# EAGLE design buffer (EAGLE 6.1)
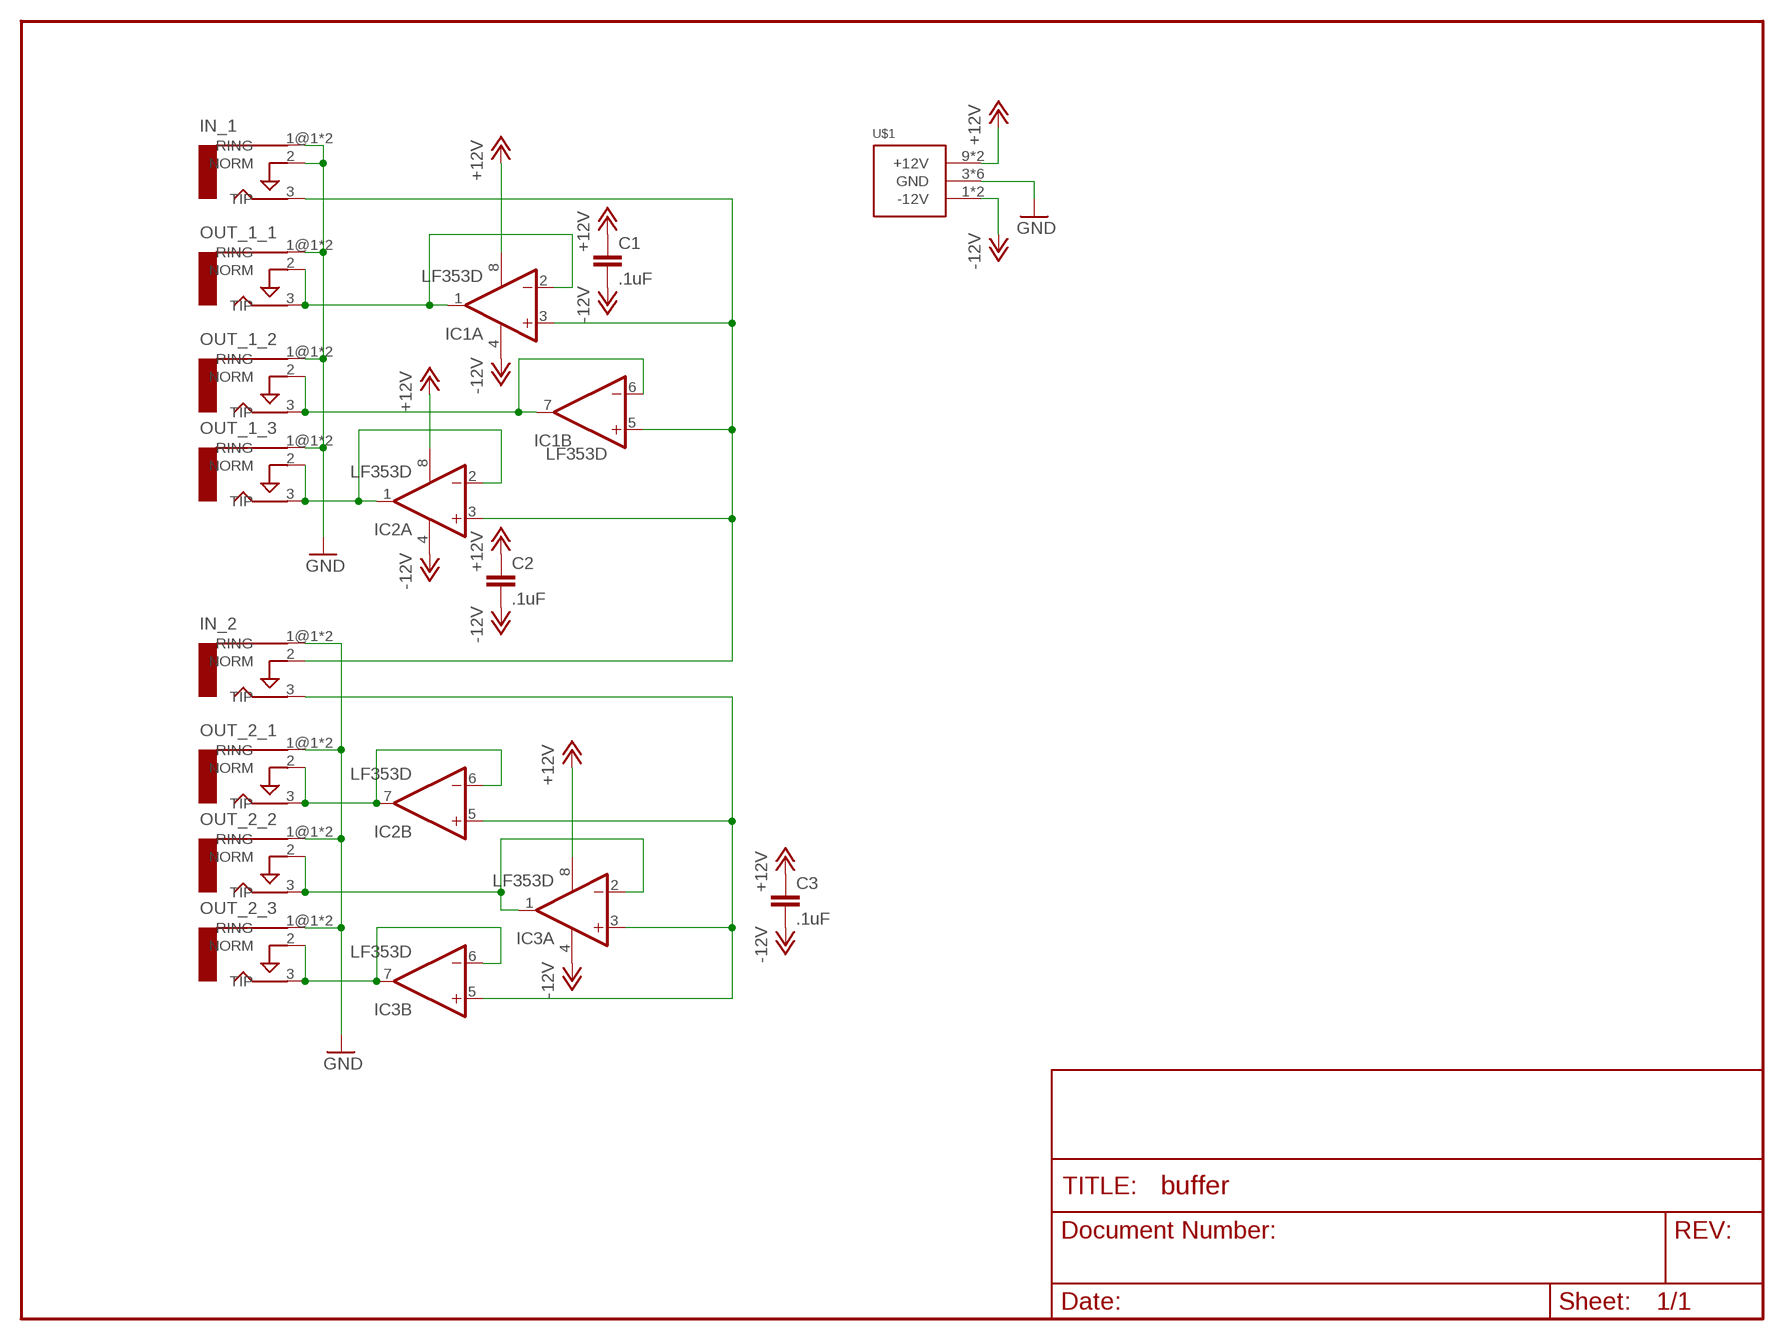
[diagram p0: schematic, sheet 1]

## Parts
C1  .1uF  CAP0603-CAP  [0603-CAP]
C2  .1uF  CAP0603-CAP  [0603-CAP]
C3  .1uF  CAP0603-CAP  [0603-CAP]
IC1  LF353D  [SO08]
IC2  LF353D  [SO08]
IC3  LF353D  [SO08]
IN_1  AUDIO-JACKERTHENVAR  [ERTHENVAR-JACK]
IN_2  AUDIO-JACKERTHENVAR  [ERTHENVAR-JACK]
OUT_1_1  AUDIO-JACKERTHENVAR  [ERTHENVAR-JACK]
OUT_1_2  AUDIO-JACKERTHENVAR  [ERTHENVAR-JACK]
OUT_1_3  AUDIO-JACKERTHENVAR  [ERTHENVAR-JACK]
OUT_2_1  AUDIO-JACKERTHENVAR  [ERTHENVAR-JACK]
OUT_2_2  AUDIO-JACKERTHENVAR  [ERTHENVAR-JACK]
OUT_2_3  AUDIO-JACKERTHENVAR  [ERTHENVAR-JACK]
U$1  POWER_SIMPLE16  [POWER_16]

## Nets
+12V: C1.1 C2.1 C3.1 IC1.8(P:V+) IC2.8(P:V+) IC3.8(P:V+) U$1.9(+12V) U$1.10(+12V)
-12V: C1.2 C2.2 C3.2 IC1.4(P:V-) IC2.4(P:V-) IC3.4(P:V-) U$1.1(-12V) U$1.2(-12V)
GND: IN_1.1@1(RING) IN_1.1@2(RING) IN_1.2(NORM) IN_2.1@1(RING) IN_2.1@2(RING) OUT_1_1.1@1(RING) OUT_1_1.1@2(RING) OUT_1_2.1@1(RING) OUT_1_2.1@2(RING) OUT_1_3.1@1(RING) OUT_1_3.1@2(RING) OUT_2_1.1@1(RING) OUT_2_1.1@2(RING) OUT_2_2.1@1(RING) OUT_2_2.1@2(RING) OUT_2_3.1@1(RING) OUT_2_3.1@2(RING) U$1.3(GND) U$1.4(GND) U$1.5(GND) U$1.6(GND) U$1.7(GND) U$1.8(GND)
N$1: IC1.1(A:OUT) IC1.2(A:-IN) OUT_1_1.2(NORM) OUT_1_1.3(TIP)
N$3: IC2.1(A:OUT) IC2.2(A:-IN) OUT_1_3.2(NORM) OUT_1_3.3(TIP)
N$4: IC1.6(B:-IN) IC1.7(B:OUT) OUT_1_2.2(NORM) OUT_1_2.3(TIP)
N$10: IC1.3(A:+IN) IC1.5(B:+IN) IC2.3(A:+IN) IN_1.3(TIP) IN_2.2(NORM)
N$11: IC2.6(B:-IN) IC2.7(B:OUT) OUT_2_1.2(NORM) OUT_2_1.3(TIP)
N$12: IC3.6(B:-IN) IC3.7(B:OUT) OUT_2_3.2(NORM) OUT_2_3.3(TIP)
N$13: IC2.5(B:+IN) IC3.3(A:+IN) IC3.5(B:+IN) IN_2.3(TIP)
N$15: IC3.1(A:OUT) IC3.2(A:-IN) OUT_2_2.2(NORM) OUT_2_2.3(TIP)

## Library data of the parts
C1-C3 = SparkFun:CAP: Capacitor Standard 0603 ceramic capacitor, and 0.1" leaded capacitor.
IC1-IC3 = linear:LF353: OP AMP
IN_1 IN_2 OUT_1_1-OUT_1_3 OUT_2_1-OUT_2_3 = erthenvar:AUDIO-JACK: Switching Mono 3.5mm Audio Jack from Erthenvar.
U$1 = eurorack:POWER_SIMPLE

## Board
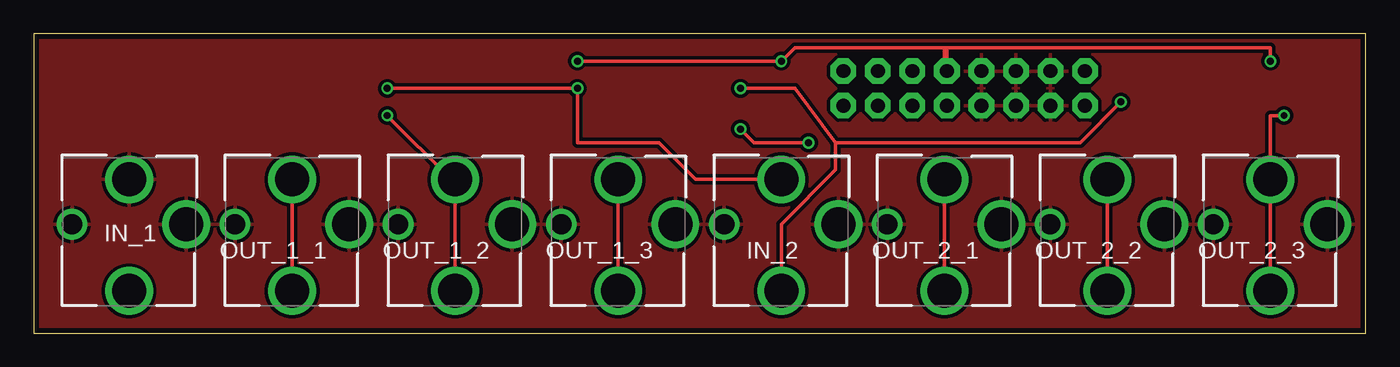
[diagram p1: board, top side]
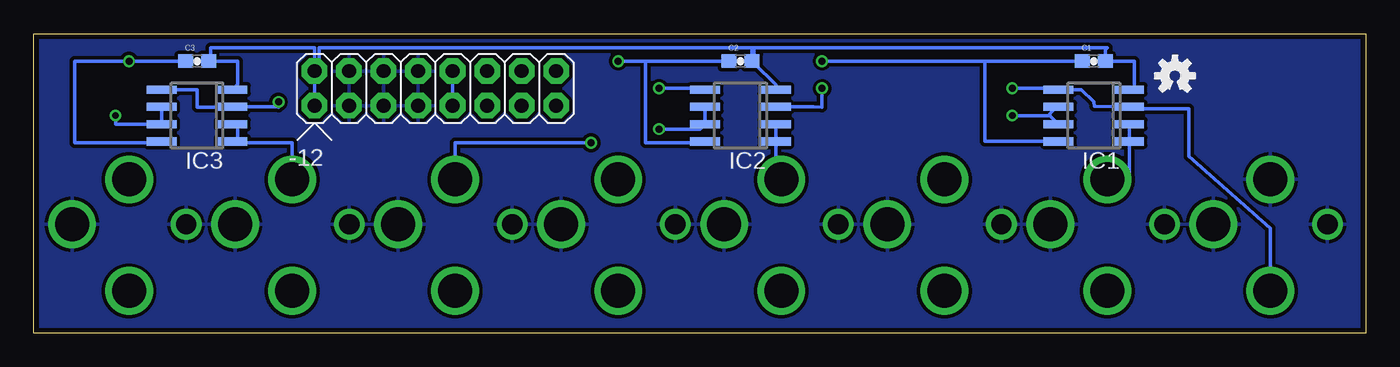
[diagram p2: board, bottom side, seen from below]

Size 98 x 22 mm. Coordinates in mm from the lower left corner, seen from the top.
Outline: 0,0 98,0 98,22 0,22 0,0
Copper layers (1*16): Top 0.0356mm / dielectric 1.5011mm / Bottom 0.0356mm
Design rules: minimum track width 6mil, minimum drill 13mil, track to track 6mil, track to pad 6mil, pad to pad 6mil, via to via 6mil, smd to smd 6mil, copper to edge 15mil, drill to drill 6mil, minimum pad ring 7mil, minimum via ring 7mil, stop-mask expansion 4mil, vias tented up to drill 0mil, thermal gap 10mil

### Footprints (pad centres in the part's own frame; a part is rotated, then mirrored left to right if it is on the bottom)
0603-CAP = smd 1.1 x 1: 1 -0.85,0; 2 0.85,0
SO08 = smd 0.6 x 2.2: 1 -1.905,-2.6; 2 -0.635,-2.6; 3 0.635,-2.6; 4 1.905,-2.6; 5 1.905,2.6; 6 0.635,2.6; 7 -0.635,2.6; 8 -1.905,2.6
ERTHENVAR-JACK = drill 2.5: 1@1 -4.2,0; 2 0,-3.3; 3 0,4.9 | drill 1.5: 1@2 4.2,0
POWER_16 = drill 1.016 pad 1.88 octagon: 1 -6.35,-1.27; 2 -6.35,1.27; 3 -3.81,-1.27; 4 -3.81,1.27; 5 -1.27,-1.27; 6 -1.27,1.27; 7 1.27,-1.27; 8 1.27,1.27; 9 3.81,-1.27; 10 3.81,1.27; 11 6.35,-1.27; 12 6.35,1.27; 13 8.89,-1.27; 14 8.89,1.27; 15 11.43,-1.27; 16 11.43,1.27

### Placement (x,y rotation side)
C1  20,20 0 bottom
C2  46,20 0 bottom
C3  86,20 0 bottom
IC1  20,16 90 bottom
IC2  46,16 90 bottom
IC3  86,16 90 bottom
IN_1  7,8 180 top
IN_2  55,8 180 top
OUT_1_1  19,8 180 top
OUT_1_2  31,8 180 top
OUT_1_3  43,8 180 top
OUT_2_1  67,8 180 top
OUT_2_2  79,8 180 top
OUT_2_3  91,8 180 top
U$1  71,18 0 bottom
U$6  [OSHW-LOGO-S]  14.03,18.92 0 bottom

### Tracks (layer width: path | path; a pad name or v marks a point on that pad's centre or on a via)
+12V  (via drill 0.51)
  Top 0.254: v40,20 v55,20 56,21 67,21 | 67,21 67,19.27 U$1.10 67.19,20.81 67,21 | 67,21 91,21 v91,20
  Bottom 0.254: C1.1 28,20 | 28,20 28,14.1 IC1.8 | C2.1 53,20 | 53,20 53,14 48.7,14 IC2.8 | 28,20 v40,20 | v55,20 53,20 | U$1.10 U$1.9 | C3.1 v91,20 95,20 95,14 88.6,14 IC3.8
-12V
  Bottom 0.254: IC1.4 17,17.91 17,20 C1.2 19.15,20.85 19,21 45,21 | 45,19.85 C2.2 45.15,21 | IC2.4 43.4,18.25 45,19.85 | 45,19.85 45,21 | 45.15,21 45,21 | 45.15,21 77,21 77,19.27 U$1.2 U$1.1 77.35,21 85,21 85,20 | 85,20 C3.2 | 85,20 83,20 83,18.3 IC3.4
GND
  Top 0.254: IN_1.2 7.9,11.3
  pour Bottom (isolate 0.254): 0,22 0,0 98,0 98,22
  pour Top (isolate 0.254): 0,22 98,22 98,0 0,0
N$1
  Top 0.254: OUT_1_1.3 OUT_1_1.2
  Bottom 0.254: IC1.2 IC1.1 17.4,11.3 OUT_1_1.2
N$3
  Top 0.254: OUT_1_3.3 OUT_1_3.2
  Bottom 0.254: OUT_1_3.2 43.4,11.3 IC2.1 IC2.2
N$4  (via drill 0.51)
  Top 0.254: OUT_1_2.3 OUT_1_2.2 30.7,11.3 v26,16
  Bottom 0.254: IC1.7 23.23,16 | 23.23,16 v26,16 | 23.23,16 23.23,16.14 22.86,16.51 22.73,16.51 IC1.6
N$10  (via drill 0.51)
  Top 0.254: v26,18 v40,18 40,14 46,14 48.7,11.3 IN_2.2
  Bottom 0.254: IN_1.3 7,7.7 13,13 13,16.5 17.4,16.5 IC1.3 19.96,16.7 20,17 20.91,17.91 IC1.5 22.7,18 v26,18 | v40,18 40,16.6 40.63,16.64 IC2.3
N$11  (via drill 0.51)
  Top 0.254: OUT_2_1.2 OUT_2_1.3 | v52,15 53,14 v57,14
  Bottom 0.254: IC2.6 IC2.7 48.97,15 v52,15 | v57,14 67,14 OUT_2_1.2 67,11
N$12  (via drill 0.51)
  Top 0.254: OUT_2_3.3 OUT_2_3.2 91,16 v92,16
  Bottom 0.254: IC3.6 IC3.7 92,15.37 v92,16
N$13  (via drill 0.51)
  Top 0.254: v52,18 56,18 59,14 | 59,14 59,12 55,8 IN_2.3 | 59,14 77,14 v80,17
  Bottom 0.254: IC2.5 48.7,18 v52,18 | IC3.5 86,17.91 86,16.6 83.4,16.6 IC3.3 80,16.64 | v80,17 80,16.64 | 80,16.6 80,16.64
N$15
  Top 0.254: OUT_2_2.2 OUT_2_2.3
  Bottom 0.254: IC3.2 83,15.37 83,14 | 83,14 83.4,14 IC3.1 | 83,14 79,14 OUT_2_2.2

### Text on the board
bDocu: alpha | Hex Buffer